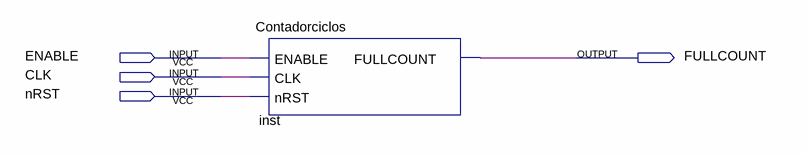
[diagram p0: schematic sheet]
// Quartus schematic CNT31.bdf as structural Verilog: 1 symbols, 4 pins
module CNT31 (
  input  ENABLE,
  input  CLK,
  input  nRST,
  output FULLCOUNT
);

  Contadorciclos inst (.ENABLE(ENABLE), .CLK(CLK), .nRST(nRST), .FULLCOUNT(FULLCOUNT));
endmodule
